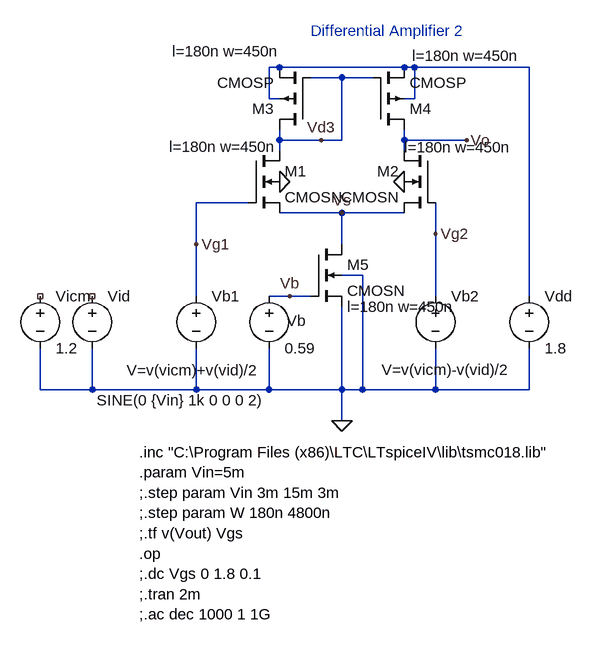
[diagram p0: schematic differential2.asc]
differential2.asc, the LTspice schematic file:
Version 4
SHEET 1 880 888
WIRE 48 64 32 64
WIRE 240 64 48 64
WIRE 256 64 240 64
WIRE 432 64 256 64
WIRE 144 80 96 80
WIRE 192 80 144 80
WIRE 32 112 32 64
WIRE 48 112 32 112
WIRE 256 112 256 64
WIRE 256 112 240 112
WIRE 48 176 48 160
WIRE 112 176 48 176
WIRE 144 176 144 80
WIRE 144 176 112 176
WIRE 240 176 240 160
WIRE 336 176 240 176
WIRE 48 192 48 176
WIRE 240 192 240 176
WIRE 0 272 -80 272
WIRE 144 288 48 288
WIRE 240 288 144 288
WIRE 288 320 288 272
WIRE -80 336 -80 272
WIRE 144 336 144 288
WIRE 176 384 144 384
WIRE -80 416 -80 336
WIRE 64 416 32 416
WIRE 96 416 64 416
WIRE 288 416 288 320
WIRE 432 416 432 64
WIRE -320 560 -320 496
WIRE -240 560 -240 496
WIRE -240 560 -320 560
WIRE -80 560 -80 496
WIRE -80 560 -240 560
WIRE 32 560 32 496
WIRE 32 560 -80 560
WIRE 144 560 144 432
WIRE 144 560 32 560
WIRE 176 560 176 384
WIRE 176 560 144 560
WIRE 288 560 288 496
WIRE 288 560 176 560
WIRE 432 560 432 496
WIRE 432 560 288 560
WIRE 144 608 144 560
FLAG 48 240 0
FLAG 240 240 0
FLAG 144 608 0
FLAG 336 176 Vo
FLAG 112 176 Vd3
FLAG 288 320 Vg2
FLAG -80 336 Vg1
FLAG 64 416 Vb
FLAG 144 288 Vs
SYMBOL cmosn 0 192 R0
WINDOW 123 -122 -6 Left 2
SYMATTR Value2 l=180n w=450n
SYMATTR InstName M1
SYMBOL cmosn 288 192 M0
WINDOW 123 -118 -5 Left 2
SYMATTR Value2 l=180n w=450n
SYMATTR InstName M2
SYMBOL cmosp 96 160 R180
WINDOW 123 47 121 Left 2
SYMATTR Value2 l=180n w=450n
SYMATTR InstName M3
SYMBOL cmosp 192 160 M180
WINDOW 123 60 114 Left 2
SYMATTR Value2 l=180n w=450n
SYMATTR InstName M4
SYMBOL cmosn 96 336 R0
WINDOW 123 56 96 Left 2
SYMATTR Value2 l=180n w=450n
SYMATTR InstName M5
SYMBOL voltage 432 400 R0
WINDOW 123 0 0 Left 2
WINDOW 39 0 0 Left 2
SYMATTR InstName Vdd
SYMATTR Value 1.8
SYMBOL voltage 32 400 R0
WINDOW 0 27 54 Left 2
WINDOW 123 0 0 Left 2
WINDOW 39 0 0 Left 2
SYMATTR InstName Vb
SYMATTR Value 0.59
SYMBOL voltage -80 400 R0
WINDOW 3 -107 130 Left 2
SYMATTR Value V=v(vicm)+v(vid)/2
SYMATTR InstName Vb1
SYMBOL voltage 288 400 R0
WINDOW 3 -83 129 Left 2
SYMATTR Value V=v(vicm)-v(vid)/2
SYMATTR InstName Vb2
SYMBOL voltage -240 400 R0
WINDOW 3 7 176 Left 2
WINDOW 123 0 0 Left 2
WINDOW 39 0 0 Left 2
SYMATTR Value SINE(0 {Vin} 1k 0 0 0 2)
SYMATTR InstName Vid
SYMBOL voltage -320 400 R0
WINDOW 123 0 0 Left 2
WINDOW 39 0 0 Left 2
SYMATTR InstName Vicm
SYMATTR Value 1.2
TEXT 96 8 Left 2 ;Differential Amplifier 2
TEXT -168 656 Left 2 !.inc "C:\\Program Files (x86)\\LTC\\LTspiceIV\\lib\\tsmc018.lib"\n.param Vin=5m\n;.step param Vin 3m 15m 3m\n;.step param W 180n 4800n\n;.tf v(Vout) Vgs\n.op\n;.dc Vgs 0 1.8 0.1\n;.tran 2m\n;.ac dec 1000 1 1G

The netlist it stands for:
* differential2.asc
M1 Vd3 Vg1 Vs 0 CMOSN l=180n w=450n
M2 Vo Vg2 Vs 0 CMOSN l=180n w=450n
M3 Vd3 Vd3 N001 N001 CMOSP l=180n w=450n
M4 Vo Vd3 N001 N001 CMOSP l=180n w=450n
M5 Vs Vb 0 0 CMOSN l=180n w=450n
Vdd N001 0 1.8
Vb Vb 0 0.59
Vb1 Vg1 0 V=v(vicm)+v(vid)/2
Vb2 Vg2 0 V=v(vicm)-v(vid)/2
Vid NC_01 0 SINE(0 {Vin} 1k 0 0 0 2)
Vicm NC_02 0 1.2
.model NMOS NMOS
.model PMOS PMOS
.lib standard.mos
* Differential Amplifier 2
.inc "C:\Program Files (x86)\LTC\LTspiceIV\lib\tsmc018.lib"
.param Vin=5m
;.step param Vin 3m 15m 3m
;.step param W 180n 4800n
;.tf v(Vout) Vgs
.op
;.dc Vgs 0 1.8 0.1
;.tran 2m
;.ac dec 1000 1 1G
.backanno
.end